# EAGLE design SparkFun_Analog_MEMS_Microphone_Breakout_ICS40180 (EAGLE 9.6.2)
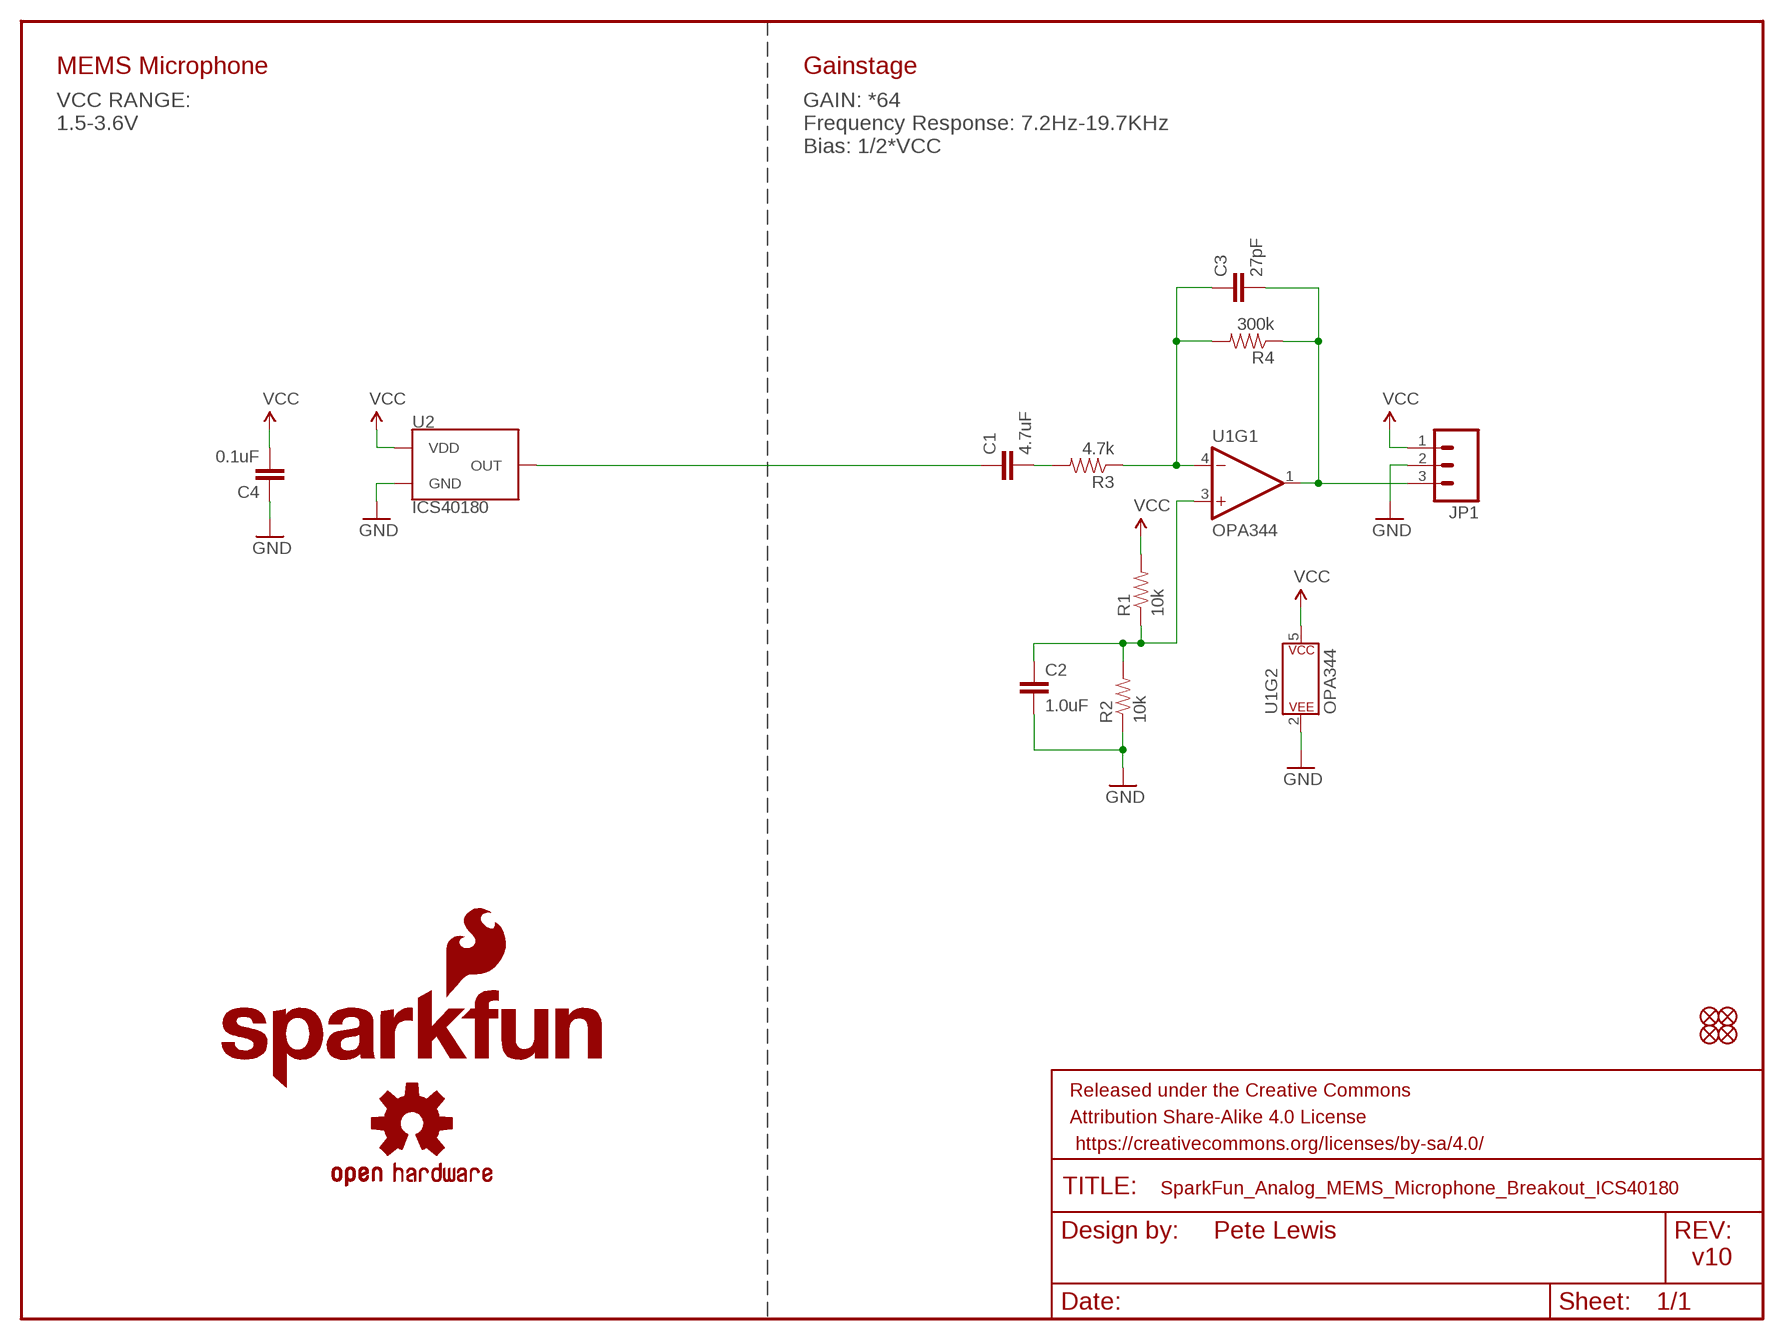
[diagram p0: schematic, sheet 1]

## Parts
C1  4.7uF  4.7UF-0603-6.3V-(10%)  [0603]
C2  1.0uF  1.0UF-0603-16V-10%  [0603]
C3  27pF  27PF-0603-50V-5%  [0603]
C4  0.1uF  0.1UF-0603-25V-(+80/-20%)  [0603]
FD1  FIDUCIALUFIDUCIAL  [FIDUCIAL-MICRO]
FD2  FIDUCIALUFIDUCIAL  [FIDUCIAL-MICRO]
FD3  FIDUCIALUFIDUCIAL  [FIDUCIAL-MICRO]
FD4  FIDUCIALUFIDUCIAL  [FIDUCIAL-MICRO]
FRAME2  FRAME-LETTER  [CREATIVE_COMMONS]
JP1  CONN_031X03_NO_SILK  [1X03_NO_SILK]
LOGO1  SFE_LOGO_FLAME.1_INCH  [SFE_LOGO_FLAME_.1]
LOGO2  OSHW-LOGOMINI  [OSHW-LOGO-MINI]
R1  10k  10KOHM-0603-1/10W-1%  [0603]
R2  10k  10KOHM-0603-1/10W-1%  [0603]
R3  4.7k  4.7KOHM-0603-1/10W-1%  [0603]
R4  300k  300KOHM-0603-1/10W-1%  [0603]
U1  OPA344  [SOT23-5]
U2  ICS40180  [ICS40180]

## Nets
AUD: C3.2 JP1.3 R4.1 U1.1(OUT)
GND: C2.2 C4.1 JP1.2 R2.1 U1.2(P$V-) U2.2(GND) U2.3(GND) U2.4(GND)
N$1: C1.1 U2.1(OUT)
N$2: C3.1 R3.1 R4.2 U1.4(-IN)
N$6: C1.2 R3.2
N$7: C2.1 R1.1 R2.2 U1.3(+IN)
VCC: C4.2 JP1.1 R1.2 U1.5(P$V+) U2.5(VDD)

## Notes on the sheet
- MEMS Microphone | Gainstage
- VCC RANGE:
  1.5-3.6V
- GAIN: *64
  Frequency Response: 7.2Hz-19.7KHz
  Bias: 1/2*VCC
- Pete Lewis
- v10

## Library data of the parts
C1 = SparkFun-Capacitors:4.7UF: 4.7µF ceramic capacitors A capacitor is a passive two-terminal electrical component used to store electrical energy temporarily in an electric field.; PROD_ID: CAP-08280
C2 = SparkFun-Capacitors:1.0UF: 1µF ceramic capacitors A capacitor is a passive two-terminal electrical component used to store electrical energy temporarily in an electric field.; PROD_ID: CAP-00868
C3 = SparkFun-Capacitors:27PF: 27pF ceramic capacitors A capacitor is a passive two-terminal electrical component used to store electrical energy temporarily in an electric field.; PROD_ID: CAP-09989
C4 = SparkFun-Capacitors:0.1UF: 0.1µF ceramic capacitors A capacitor is a passive two-terminal electrical component used to store electrical energy temporarily in an electric field.; PROD_ID: CAP-00810
FD1-FD4 = SparkFun-Aesthetics:FIDUCIAL: Fiducial Alignment Points Point-of-reference for pick-and-place machines and other optical instruments.
FRAME2 = SparkFun-Aesthetics:FRAME-LETTER: Schematic Frame - Letter Standard 8.5x11 US Letter frame
JP1 = SparkFun-Connectors:CONN_03: Multi connection point. Often used as Generic Header-pin footprint for 0.1 inch spaced/style header connections On any of the 0.1 inch spaced packages, you can populate with these: Break Away Headers - Straight <https://www.sparkfun.com/products/116> (PRT-00116) Break Away Male Headers - Right Angle <https://www.sparkfun.com/products/553> (PRT-00553) Female Headers <https://www.sparkfun.com/products/115> (PRT-00115) Break Away Headers - Machine Pin <https://www.sparkfun.com/products/117> (PRT-00117) Break Away Female Headers - Swiss Machine Pin <https://www.sparkfun.com/products/743> (PRT-00743) Stackable Header - 3 Pin (Female, 0.1") <https://www.sparkfun.com/products/13875> (PRT-13875) For SCREWTERMINALS and SPRING TERMINALS visit here: Screw Terimnals on SparkFun.com <https://www.sparkfun.com/search/results?term=Screw+Terminals> (5mm/3.5mm/2.54mm spacing) This device is also useful as a general connection point to wire up your design to another part of your project. Our various solder wires solder well into these plated through hole pads. Hook-Up Wire - Assortment (Stranded, 22 AWG) <https://www.sparkfun.com/products/11375> (PRT-11375) Hook-Up Wire - Assortment (Solid Core, 22 AWG) <https://www.sparkfun.com/products/11367> (PRT-11367) View the entire wire category on our website here <https://www.sparkfun.com/categories/141> Special notes: Molex polarized connector foot print use with SKU : PRT-08232 with associated crimp pins and housings.
LOGO1 = SparkFun-Aesthetics:SFE_LOGO_FLAME: SparkFun Flame Logo This is the SparkFun flame logo. The logo on the schematic will always be the same size; the package variant is the height of the flame. Default layer for the logo on the board is tSilk.
LOGO2 = SparkFun-Aesthetics:OSHW-LOGO: Open-Source Hardware (OSHW) Logo This logo indicates the piece of hardware it is found on incorporates a OSHW license and/or adheres to the definition of open source hardware found here: http://freedomdefined.org/OSHW
R1 R2 = SparkFun-Resistors:10KOHM: 10kΩ resistor A resistor is a passive two-terminal electrical component that implements electrical resistance as a circuit element. Resistors act to reduce current flow, and, at the same time, act to lower voltage levels within circuits. - Wikipedia; PROD_ID: RES-00824
R3 = SparkFun-Resistors:4.7KOHM: 4.7kΩ resistor A resistor is a passive two-terminal electrical component that implements electrical resistance as a circuit element. Resistors act to reduce current flow, and, at the same time, act to lower voltage levels within circuits. - Wikipedia; PROD_ID: RES-07857
R4 = SparkFun-Resistors:300KOHM: 300kΩ resistor A resistor is a passive two-terminal electrical component that implements electrical resistance as a circuit element. Resistors act to reduce current flow, and, at the same time, act to lower voltage levels within circuits. - Wikipedia; PROD_ID: RES-10809
U1 = SparkFun-IC-Amplifiers:OPA344: Single gate rail-to-rail output op-amp. Inputs extend 300mV past rails. Datasheet <http://www.ti.com/product/OPA344> SparkFun Products SparkFun Low Current Sensor <https://www.sparkfun.com/products/8883> (SEN-08883) SparkFun Electret Microphone Breakout <https://www.sparkfun.com/products/12758> (BOB-12758); PROD_ID: IC-08251
U2 = SparkFun-Sensors:ICS40180: ICS-40180 - RF-Hardened, Low-Noise MEMs Microphone with Bottom Port and Analog Output The ICS-40180* is an analog MEMS microphone with high SNR and enhanced RF immunity. The ICS-40180 includes a MEMS microphone element, an impedance converter, and an output amplifier. Other high-performance specification include a linear response up to 124 dB SPL, tight ±1 dB sensitivity tolerance, and enhanced immunity to both radiated and conducted RF interference. The ICS-40180 is available in a small, 3.5 mm × 2.65 mm × 0.98 mm, surface-mount package. Datasheet <https://invensense.tdk.com/wp-content/uploads/2015/02/DS-000021-v1.22.pdf> SparkFun Products SparkFun MEMS Microphone Breakout - ICS-40180 <https://www.sparkfun.com/products/18011> (BOB-18011) MEMS Microphone - ICS40180 <https://www.sparkfun.com/products/18010> (COM-18010); PROD_ID: IC-15819

## Board
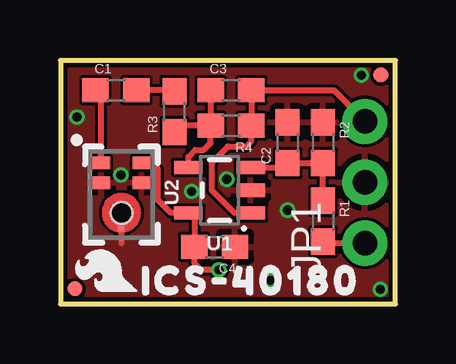
[diagram p1: board, top side]
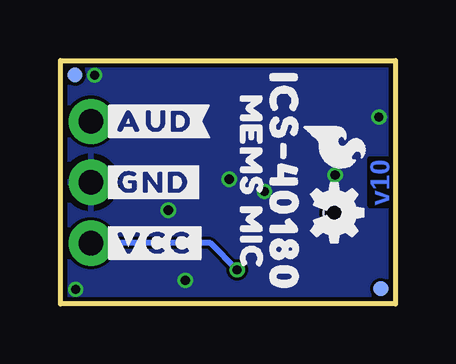
[diagram p2: board, bottom side, seen from below]

Size 13.97 x 10.16 mm. Coordinates in mm from the lower left corner, seen from the top.
Outline: 0,0 13.97,0 13.97,10.16 0,10.16 0,0
Copper layers (1*16): Top 0.035mm / dielectric 1.5mm / Bottom 0.035mm
Design rules "SparkFun-2-Layer-Minimum-JLCPCB": minimum track width 5mil, minimum drill 0.3mm, track to track 5mil, track to pad 5mil, pad to pad 5mil, via to via 5mil, smd to smd 5mil, copper to edge 7mil, drill to drill 7mil, minimum pad ring 5mil, minimum via ring 5mil, stop-mask expansion 2.5mil, vias tented up to drill 25mil, thermal gap 10mil

### Footprints (pad centres in the part's own frame; a part is rotated, then mirrored left to right if it is on the bottom)
0603 = smd 1.1 x 1: 1 -0.85,0; 2 0.85,0
FIDUCIAL-MICRO = smd 0.635 x 0.635: 1 0,0
1X03_NO_SILK = drill 1.016 pad 1.88: 1 0,0; 2 2.54,0; 3 5.08,0
SOT23-5 = smd 0.55 x 1.2: 1 -0.95,-1.3; 2 0,-1.3; 3 0.95,-1.3; 4 0.95,1.3; 5 -0.95,1.3
ICS40180 = smd 0.522 x 0.725: 1 -2.074,-0.838; 2 -1.252,-0.838; 4 -1.252,0.838; 5 -2.074,0.838 | smd 0.25 x 0.25: 3 0.66,-0.01 | hole 0.9: 0,0

### Placement (x,y rotation side)
C1  2.31,8.92 0 top
C2  9.47,6.73 90 top
C3  7.11,8.92 0 top
C4  6.43,2.39 180 top
FD1  13.36,9.55 0 top
FD2  13.36,9.55 0 bottom
FD3  0.61,0.64 0 top
FD4  0.61,0.64 0 bottom
FRAME2  -19.05,-11.43 0 top  (outside the outline)
JP1  12.7,2.54 90 top
LOGO1  2.51,6.55 270 bottom
LOGO2  2.54,3.81 270 bottom
LOGO3  SFE_LOGO_FLAME.1_INCH  [SFE_LOGO_FLAME_.1]  1.88,1.37 90 top
R1  10.95,3.45 270 top
R2  10.95,6.73 270 top
R3  4.75,8.03 90 top
R4  7.11,7.44 180 top
U1  6.63,4.75 90 top
U2  2.54,3.81 270 top
U$1  [ICS#401800]  4.67,5.08 270 bottom
U$2  [MEMS_MIC0]  6.02,5.08 270 bottom
U$3  [#GND#0]  12.32,5.08 0 bottom
U$4  [#VCC#0]  12.32,2.54 0 bottom
U$5  [#AUD#0]  12.32,7.62 0 bottom
U$6  [ICS#401800]  7.92,0.97 0 top

### Tracks (layer width: path | path; a pad name or v marks a point on that pad's centre or on a via)
AUD
  Top 0.254: U1.1 7.25,3.8 6.31,4.74 6.31,5.9 6.99,6.58 7.75,6.58 7.96,6.79 R4.1 C3.2 11.4,8.91 JP1.3
GND  (via drill 0.38)
  Top 0.254: U2.3 2.53,2.53
  other vias: 6.93,5.21 0.69,7.8 12.55,9.55 13.34,0.61 8.76,0.99 2.51,5.38 9.47,3.91 5.46,4.7
  pour Bottom: 0,0 0,10.16 13.97,10.16 13.97,0
  pour Top: 0,0 0,10.16 13.97,10.16 13.97,0
N$1
  Top 0.254: C1.1 1.7,8.68 U2.1
N$2
  Top 0.254: C3.1 R4.2 | R4.2 5.02,7.44 R3.1 | U1.4 5.33,6.14 5.61,6.43 5.97,6.43 6.26,6.72 R4.2
N$6
  Top 0.254: R3.2 4.71,8.91 C1.2
N$7
  Top 0.254: U1.3 9.29,5.7 C2.1 R2.2 R1.1
VCC  (via drill 0.38)
  Top 0.254: U2.5 3.82,5.88 4.06,5.64 4.06,4.34 4.61,3.8 U1.5 5.58,3.55 C4.2 5.58,1.71 5.87,1.42 v6.6,1.42 | R1.2 11.01,2.54 JP1.1
  Bottom 0.254: v6.6,1.42 7.72,2.54 JP1.1

### Text on the board
Bottom: v10
tValues: Mic Breakout
Measures: Units: INCHES
tDocu: Pete Lewis